# Altium project PHX_COLDFLOW_INTERFACE.PrjPcb
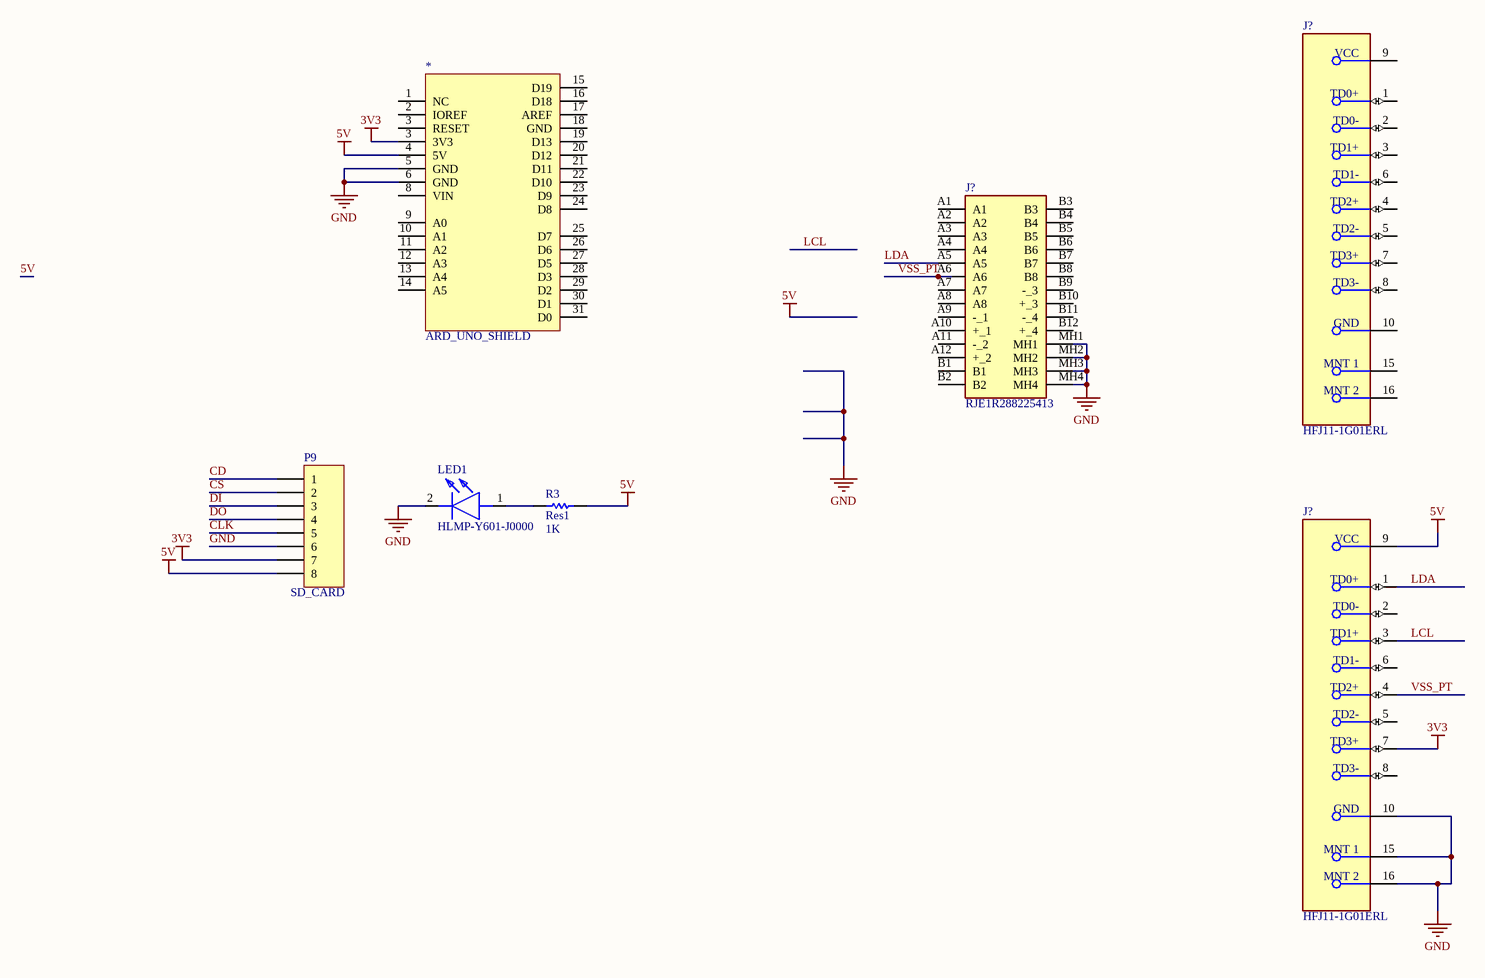
[diagram p0: PHX_COLDFLOW_MAIN.SchDoc]
1 sheet, 7 parts. Net scope: global (net labels, ports and power ports of the same name join across sheets).
Board file: PHX_COLDFLOW_CONTROLLER.PcbDoc

## Sheet PHX_COLDFLOW_MAIN.SchDoc
size B

### Parts
(Parts that share a designator on the sheet are numbered #1, #2 ... from top to bottom, then left to right.)
*  ARD_UNO_SHIELD  [UNO_SHIELD]
J?#1  HFJ11-1G01ERL  [FP-HFJ11-1G01ERL-MFG]
J?#2  RJE1R288225413  [RJE1R288225413]
J?#3  HFJ11-1G01ERL  [FP-HFJ11-1G01ERL-MFG]
LED1  HLMP-Y601-J0000  [HLMPY601J0000]
P9  SD_CARD  [HDR1X8]
R3  Res1  value 1K  [6-0805_L]

### Nets
3V3: *.3(3V3) J?#3.7(TD3+) P9.7
5V: *.4(5V) J?#3.9(VCC) P9.8 R3.1
GND: *.5(GND) *.6(GND) J?#2.MH1 J?#2.MH2 J?#2.MH3 J?#2.MH4 J?#3.10(GND) J?#3.15(MNT_1) J?#3.16(MNT_2) LED1.2(K) P9.6
CD: P9.1
CLK: P9.5
CS: P9.2
DI: P9.3
DO: P9.4
LCL: J?#3.3(TD1+)
LDA: J?#2.A5 J?#3.1(TD0+)
VSS_PT: J?#2.A6 J?#3.4(TD2+)
NetLED1_1: LED1.1(A) R3.2

Not connected (* = marked no-connect by the designer): * 1(NC) 2(IOREF) 8(VIN) 9(A0) 10(A1) 11(A2) 12(A3) 13(A4) 14(A5) 15(D19) 16(D18) 17(AREF) 18(GND) 19(D13) 20(D12) 21(D11) 22(D10) 23(D9) 24(D8) 25(D7) 26(D6) 27(D5) 28(D3) 29(D2) 30(D1) 31(D0); J?#1 1(TD0+) 2(TD0-) 3(TD1+) 4(TD2+) 5(TD2-) 6(TD1-) 7(TD3+) 8(TD3-) 9(VCC) 10(GND) 15(MNT_1) 16(MNT_2); J?#2 A1 A2 A3 A4 A7 A8 A9(-_1) A10(+_1) A11(-_2) A12(+_2) B1 B2 B3 B4 B5 B6 B7 B8 B9(-_3) B10(+_3) B11(-_4) B12(+_4); J?#3 2(TD0-) 5(TD2-) 6(TD1-) 8(TD3-)

### Notes on the sheet
- Title
- Size:
- Date:
- B
- Number:
- Time:
- Revision:
- Sheet
- of
- File:

### Library data of the parts
* = ARD_UNO_SHIELD: Arduino uno shield pinout
J?#1 J?#3 = CMP-218039-000001-2: Conn RJ-45 F 8 POS 2.54mm Solder RA Thru-Hole 10 Terminal 1 Port; Manufacturer: HALO; Pitch: 1.27mm; Number Of Contacts: 8; Shielding: true; Conn Orientation: Horizontal; Conn Gender: Female; Is Female: yes; Manufacturer Part Number: HFJ11-1G01ERL; Device Class L1: Connectors; Device Class L2: Modular / Ethernet Connectors; Category: Conn; Automotive: No; ComponentLink2Description: Datasheet; Device Class L3: unset; Lead Free: Yes; Temperature Range Low: 0°C; Mouser Description: Conn RJ-45 F 8 POS 2.54mm Solder RA Thru-Hole 10 Terminal 1 Port; Temperature: 0°C to +70°C; Temperature Range High: +70°C; Package: 0; Contact Material: Gold; Height: 0.624inch; ComponentLink2URL: https://www.haloelectronics.com/pdf/fastjack-gigabit.pdf; Octopart: https://octopart.com/hfj11-1g01erl-halo-4052130; RoHS: TRUE
J?#2 = RJE1R288225413: Connector; Manufacturer_Name: Amphenol Communications Solutions; Datasheet Link: https://cdn.amphenol-cs.com/media/wysiwyg/files/drawing/rje1r288xx5xxx.pdf; Height: 26.5mm; Manufacturer_Part_Number: RJE1R288225413; Mouser Part Number: 523-RJE1R288225413; Mouser Price/Stock: https://www.mouser.co.uk/ProductDetail/Amphenol-Commercial-Products/RJE1R288225413?qs=vLWxofP3U2xTD8IjigT%252BMg%3D%3D; Arrow Part Number: RJE1R288225413; Arrow Price/Stock: https://www.arrow.com/en/products/rje1r288225413/amphenol
LED1 = HLMP-Y601-J0000: LED; Manufacturer_Name: Avago Technologies; Datasheet Link: https://componentsearchengine.com/Datasheets/2/HLMP-Y601-J0000.pdf; Height: 6.2mm; Manufacturer_Part_Number: HLMP-Y601-J0000; Mouser Part Number: 630-HLMP-Y601-J0000; Mouser Price/Stock: https://www.mouser.co.uk/ProductDetail/Broadcom-Avago/HLMP-Y601-J0000/?qs=eQsPqqG3NqZlsxOZsiOi8g%3D%3D
P9 = Header 8: Header, 8-Pin; LatestRevisionDate: 17-Jul-2002; LatestRevisionNote: Re-released for DXP Platform.; Publisher: Altium Limited
R3 = Res1: Resistor; Published: 8-Jun-2000; LatestRevisionDate: 17-Jul-2002; LatestRevisionNote: Re-released for DXP Platform.; PackageReference: AXIAL-0.3; Publisher: Altium Limited; PackageDescription: Axial Device, Thru-Hole; 2 Leads; 0.3 in Pin Spacing